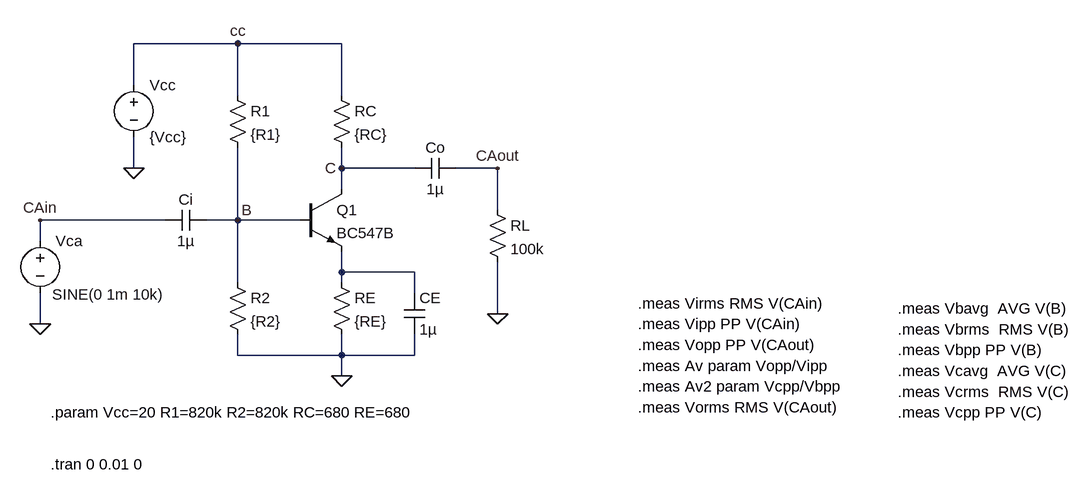
[diagram p0: schematic TBJ02CA.asc]
TBJ02CA.asc, the LTspice schematic file:
Version 4
SHEET 1 1668 1200
WIRE 128 -16 -32 -16
WIRE 288 -16 128 -16
WIRE -32 48 -32 -16
WIRE 128 64 128 -16
WIRE 288 64 288 -16
WIRE -32 176 -32 128
WIRE 288 176 288 144
WIRE 400 176 288 176
WIRE 528 176 464 176
WIRE 288 208 288 176
WIRE 528 240 528 176
WIRE 16 256 -176 256
WIRE 128 256 128 144
WIRE 128 256 80 256
WIRE 224 256 128 256
WIRE -176 288 -176 256
WIRE 288 336 288 304
WIRE 400 336 288 336
WIRE 128 352 128 256
WIRE 288 352 288 336
WIRE 400 368 400 336
WIRE 528 400 528 320
WIRE -176 416 -176 368
WIRE 128 464 128 432
WIRE 288 464 288 432
WIRE 288 464 128 464
WIRE 400 464 400 432
WIRE 400 464 288 464
WIRE 288 496 288 464
FLAG -32 176 0
FLAG 288 496 0
FLAG -176 416 0
FLAG 128 -16 cc
FLAG -176 256 CAin
FLAG 528 400 0
FLAG 528 176 CAout
FLAG 128 256 B
FLAG 288 176 C
SYMBOL res 112 48 R0
SYMATTR InstName R1
SYMATTR Value {R1}
SYMBOL res 272 48 R0
SYMATTR InstName RC
SYMATTR Value {RC}
SYMBOL voltage -32 32 R0
WINDOW 123 0 0 Left 0
WINDOW 39 0 0 Left 0
SYMATTR InstName Vcc
SYMATTR Value {Vcc}
SYMBOL npn 224 208 R0
SYMATTR InstName Q1
SYMATTR Value BC547B
SYMBOL cap 80 240 R90
WINDOW 0 0 32 VBottom 2
WINDOW 3 32 32 VTop 2
SYMATTR InstName Ci
SYMATTR Value 1µ
SYMBOL cap 464 160 R90
WINDOW 0 0 32 VBottom 2
WINDOW 3 32 32 VTop 2
SYMATTR InstName Co
SYMATTR Value 1µ
SYMBOL voltage -176 272 R0
WINDOW 123 0 0 Left 0
WINDOW 39 0 0 Left 0
WINDOW 3 18 98 Left 2
SYMATTR Value SINE(0 1m 10k)
SYMATTR InstName Vca
SYMBOL res 512 224 R0
SYMATTR InstName RL
SYMATTR Value 100k
SYMBOL res 272 336 R0
SYMATTR InstName RE
SYMATTR Value {RE}
SYMBOL cap 384 368 R0
SYMATTR InstName CE
SYMATTR Value 1µ
SYMBOL res 112 336 R0
SYMATTR InstName R2
SYMATTR Value {R2}
TEXT -160 632 Left 2 !.tran 0 0.01 0
TEXT -160 552 Left 2 !.param Vcc=20 R1=820k R2=820k RC=680 RE=680
TEXT 744 416 Left 2 !.meas Vipp PP V(CAin)
TEXT 744 448 Left 2 !.meas Vopp PP V(CAout)
TEXT 744 480 Left 2 !.meas Av param Vopp/Vipp
TEXT 744 384 Left 2 !.meas Virms RMS V(CAin)
TEXT 1144 456 Left 2 !.meas Vbpp PP V(B)
TEXT 1144 424 Left 2 !.meas Vbrms  RMS V(B)
TEXT 1144 392 Left 2 !.meas Vbavg  AVG V(B)
TEXT 1144 552 Left 2 !.meas Vcpp PP V(C)
TEXT 1144 520 Left 2 !.meas Vcrms  RMS V(C)
TEXT 1144 488 Left 2 !.meas Vcavg  AVG V(C)
TEXT 744 512 Left 2 !.meas Av2 param Vcpp/Vbpp
TEXT 744 544 Left 2 !.meas Vorms RMS V(CAout)

The netlist it stands for:
* TBJ02CA.asc
R1 cc B {R1}
RC cc C {RC}
Vcc cc 0 {Vcc}
Q1 C B N001 0 BC547B
Ci B CAin 1µ
Co CAout C 1µ
Vca CAin 0 SINE(0 1m 10k)
RL CAout 0 100k
RE N001 0 {RE}
CE N001 0 1µ
R2 B 0 {R2}
.model NPN NPN
.model PNP PNP
.lib standard.bjt
.tran 0 0.01 0
.param Vcc=20 R1=820k R2=820k RC=680 RE=680
.meas Vipp PP V(CAin)
.meas Vopp PP V(CAout)
.meas Av param Vopp/Vipp
.meas Virms RMS V(CAin)
.meas Vbpp PP V(B)
.meas Vbrms  RMS V(B)
.meas Vbavg  AVG V(B)
.meas Vcpp PP V(C)
.meas Vcrms  RMS V(C)
.meas Vcavg  AVG V(C)
.meas Av2 param Vcpp/Vbpp
.meas Vorms RMS V(CAout)
.backanno
.end